# Altium schematic sheet Connectors.SchDoc
size 420 x 297 mm
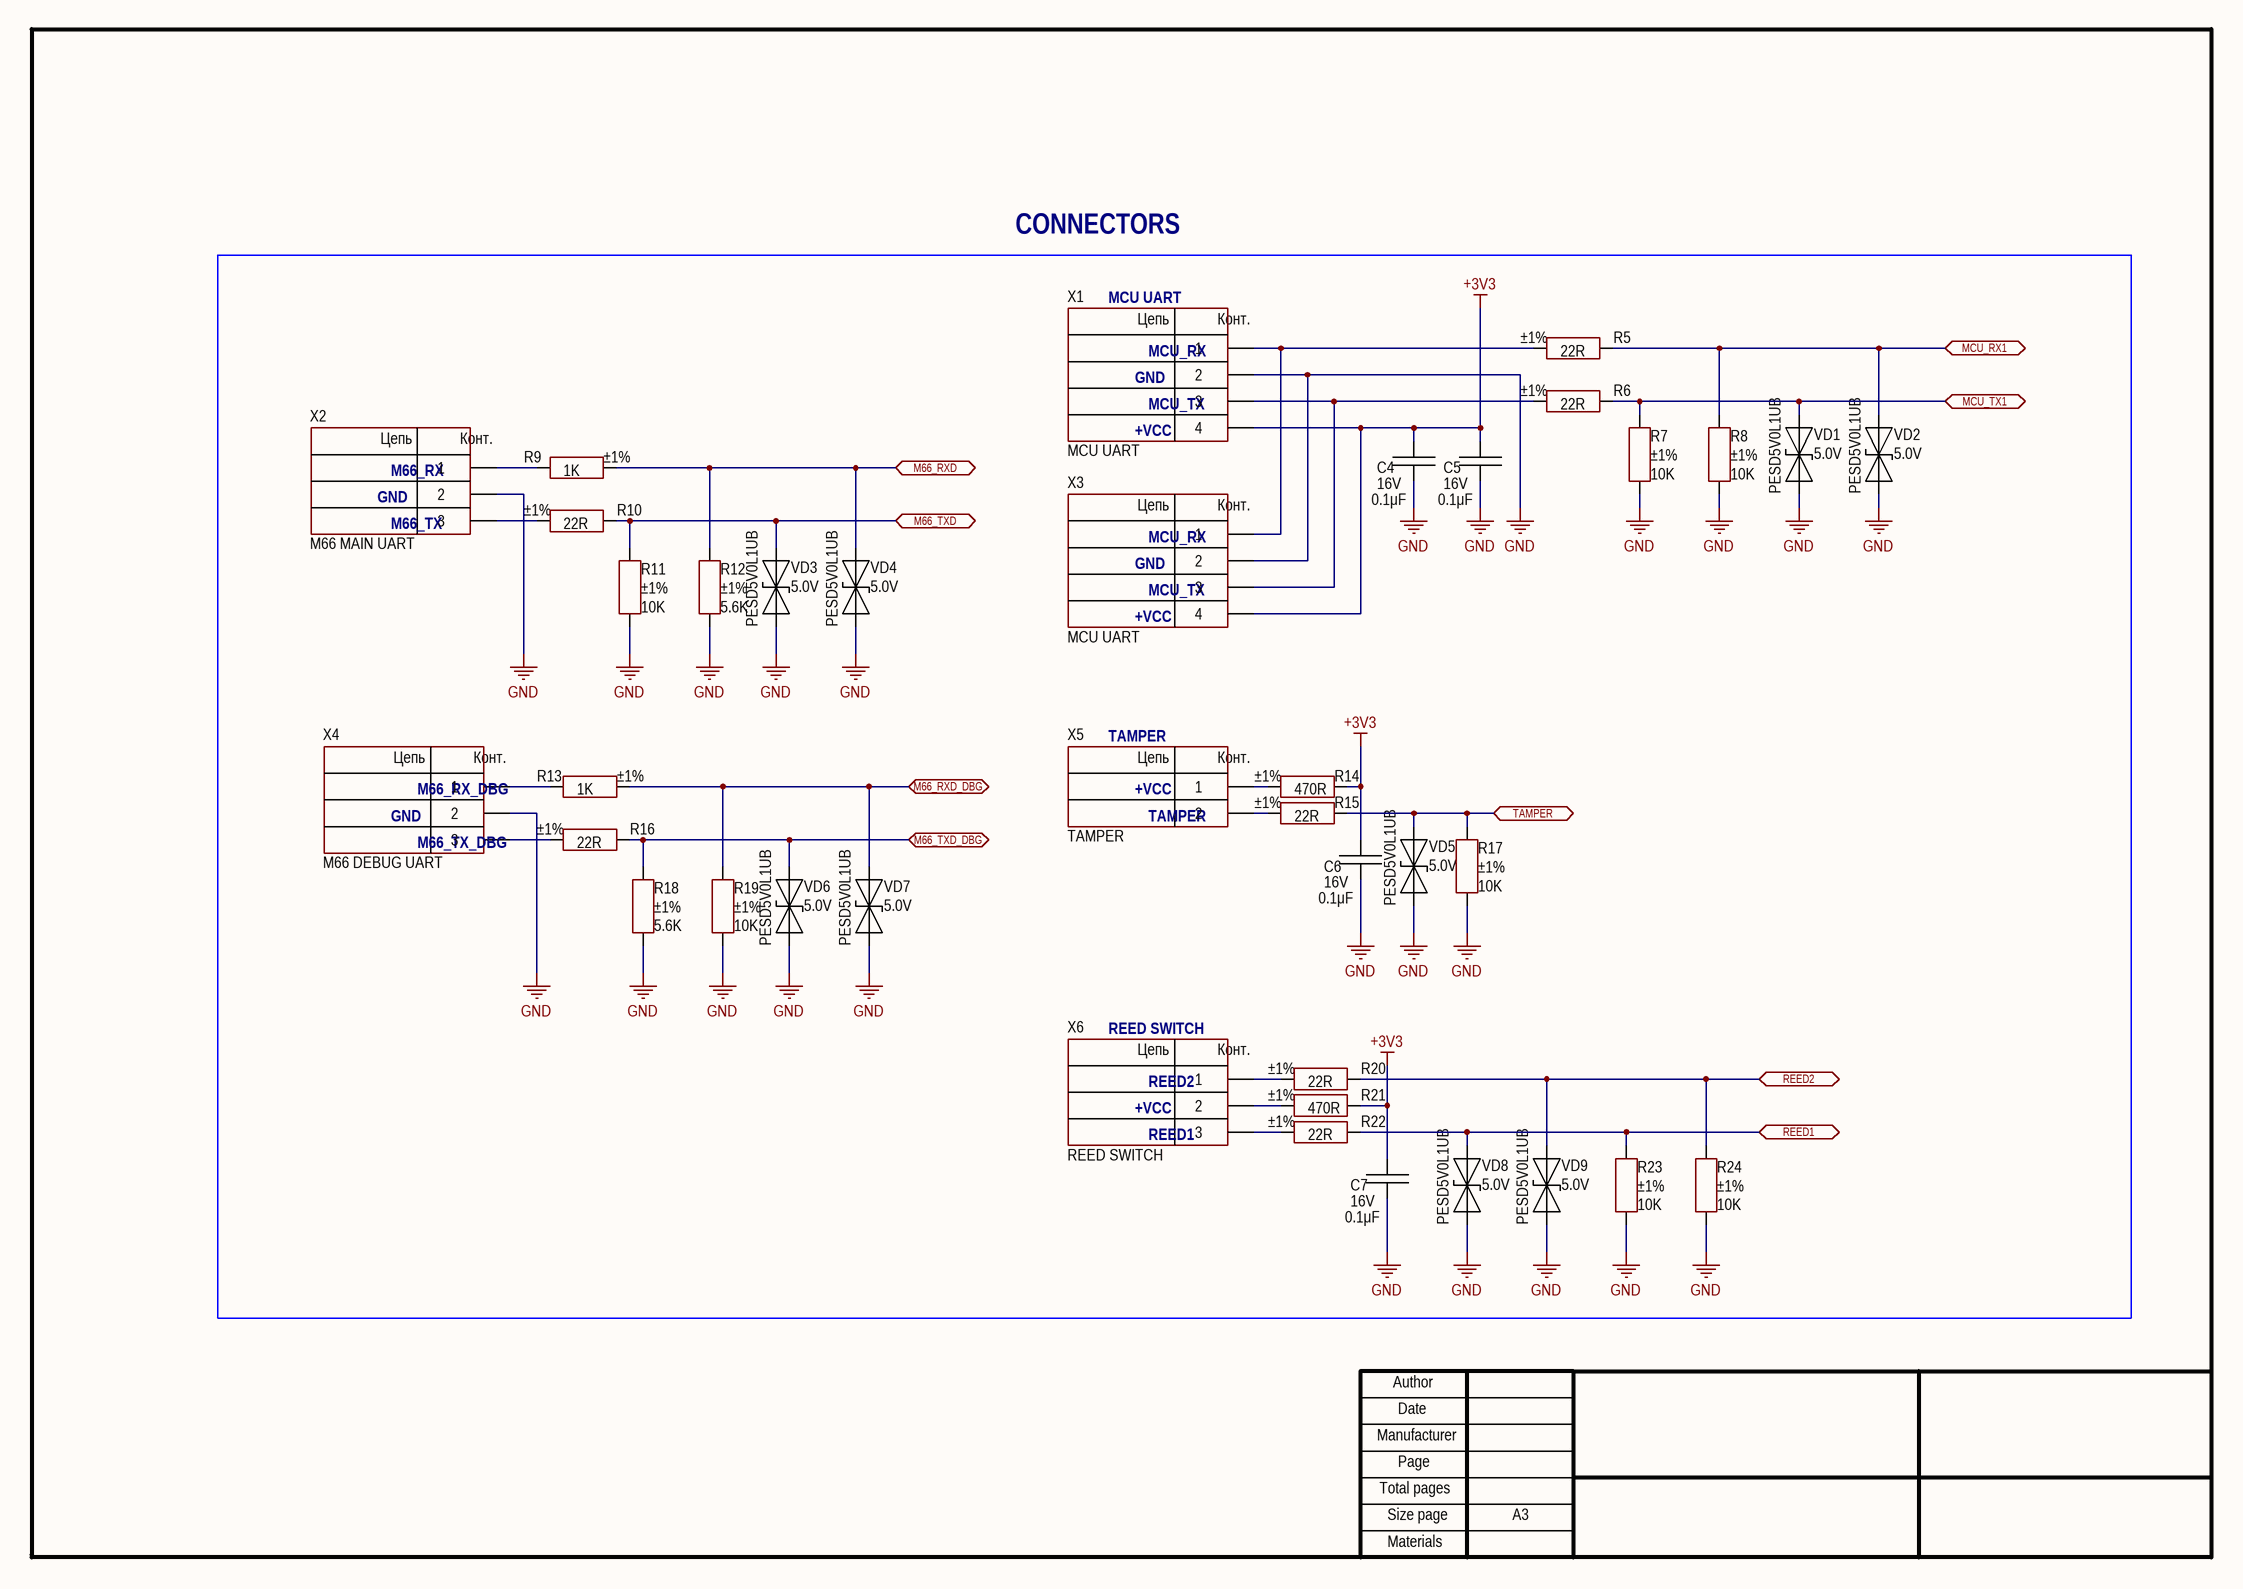
[diagram p0: Connectors.SchDoc]

## Parts
C4  value 0.1μF  Voltage: 16V  [CAP: 0402]
C5  value 0.1μF  Voltage: 16V  [CAP: 0402]
C6  value 0.1μF  Voltage: 16V  [CAP: 0402]
C7  value 0.1μF  Voltage: 16V  [CAP: 0402]
R5  value 22R  Tolerance: ±1%  [RES: 0402]
R6  value 22R  Tolerance: ±1%  [RES: 0402]
R7  value 10K  Tolerance: ±1%  [RES: 0402]
R8  value 10K  Tolerance: ±1%  [RES: 0402]
R9  value 1K  Tolerance: ±1%  [RES: 0402]
R10  value 22R  Tolerance: ±1%  [RES: 0402]
R11  value 10K  Tolerance: ±1%  [RES: 0402]
R12  value 5.6K  Tolerance: ±1%  [RES: 0402]
R13  value 1K  Tolerance: ±1%  [RES: 0402]
R14  value 470R  Tolerance: ±1%  [RES: 0402]
R15  value 22R  Tolerance: ±1%  [RES: 0402]
R16  value 22R  Tolerance: ±1%  [RES: 0402]
R17  value 10K  Tolerance: ±1%  [RES: 0402]
R18  value 5.6K  Tolerance: ±1%  [RES: 0402]
R19  value 10K  Tolerance: ±1%  [RES: 0402]
R20  value 22R  Tolerance: ±1%  [RES: 0402]
R21  value 470R  Tolerance: ±1%  [RES: 0402]
R22  value 22R  Tolerance: ±1%  [RES: 0402]
R23  value 10K  Tolerance: ±1%  [RES: 0402]
R24  value 10K  Tolerance: ±1%  [RES: 0402]
VD1  Voltage: 5.0V  PartNumber: PESD5V0L1UB  [DIODE: SOD523]
VD2  Voltage: 5.0V  PartNumber: PESD5V0L1UB  [DIODE: SOD523]
VD3  Voltage: 5.0V  PartNumber: PESD5V0L1UB  [DIODE: SOD523]
VD4  Voltage: 5.0V  PartNumber: PESD5V0L1UB  [DIODE: SOD523]
VD5  Voltage: 5.0V  PartNumber: PESD5V0L1UB  [DIODE: SOD523]
VD6  Voltage: 5.0V  PartNumber: PESD5V0L1UB  [DIODE: SOD523]
VD7  Voltage: 5.0V  PartNumber: PESD5V0L1UB  [DIODE: SOD523]
VD8  Voltage: 5.0V  PartNumber: PESD5V0L1UB  [DIODE: SOD523]
VD9  Voltage: 5.0V  PartNumber: PESD5V0L1UB  [DIODE: SOD523]
X1  CommentText: MCU UART  [CON: PLS-4]
X2  CommentText: M66 MAIN UART  [CON: PLS-3]
X3  CommentText: MCU UART  [CON: PLS-4]
X4  CommentText: M66 DEBUG UART  [CON: PLS-3]
X5  CommentText: TAMPER  [CON: PLS-2]
X6  CommentText: REED SWITCH  [CON: 282834-3]

## Ports
M66_RXD (bidir), M66_RXD_DBG (bidir), M66_TXD (bidir), M66_TXD_DBG (bidir), MCU_RX1 (bidir), MCU_TX1 (bidir), REED1 (bidir), REED2 (bidir), TAMPER (bidir)

## Nets
+3V3: C4.1 C5.1 C6.1 C7.1 R14.1 R21.1 X1.4 X3.4
GND: C4.2 C5.2 C6.2 C7.2 R7.2 R8.2 R11.1 R12.1 R17.1 R18.1 R19.1 R23.1 R24.1 VD1.1(A) VD2.1(A) VD3.1(A) VD4.1(A) VD5.1(A) VD6.1(A) VD7.1(A) VD8.1(A) VD9.1(A) X1.2 X2.2 X3.2 X4.2
M66_RXD: R9.2 R12.2 VD4.2(C) ; port M66_RXD
M66_RXD_DBG: R13.2 R19.2 VD7.2(C) ; port M66_RXD_DBG
M66_TXD: R10.2 R11.2 VD3.2(C) ; port M66_TXD
M66_TXD_DBG: R16.2 R18.2 VD6.2(C) ; port M66_TXD_DBG
MCU_RX1: R5.2 R8.1 VD2.2(C) ; port MCU_RX1
MCU_TX1: R6.2 R7.1 VD1.2(C) ; port MCU_TX1
REED1: R22.2 R23.2 VD8.2(C) ; port REED1
REED2: R20.2 R24.2 VD9.2(C) ; port REED2
TAMPER: R15.2 R17.2 VD5.2(C) ; port TAMPER
NetR5_1: R5.1 X1.1 X3.1
NetR6_1: R6.1 X1.3 X3.3
NetR9_1: R9.1 X2.1
NetR10_1: R10.1 X2.3
NetR13_1: R13.1 X4.1
NetR14_2: R14.2 X5.1
NetR15_1: R15.1 X5.2
NetR16_1: R16.1 X4.3
NetR20_1: R20.1 X6.1
NetR21_2: R21.2 X6.2
NetR22_1: R22.1 X6.3

## Notes on the sheet
- CONNECTORS
- MCU UART
- GND
- MCU_RX
- +VCC
- MCU_TX
- M66_RX
- M66_TX
- M66_RX_DBG
- TAMPER
- M66_TX_DBG
- (near X6) REED SWITCH
- REED2
- REED1
- Author
- Manufacturer
- Date
- Page
- Total pages
- Size page
- A3
- Materials
- (in symbol KLS2-308V-2.54-03P-4S) Цепь; Конт.
- (in symbol PLS-2) Цепь; Конт.
- (in symbol PLS-3) Цепь; Конт.
- (in symbol PLS-4) Цепь; Конт.

## Library data of the parts
C4-C7 = Ceramic_0402: ±10% 16V Ceramic Capacitor X7R 0402 (1005 Metric); Manufacturer: Yageo; PartNumber: CC0402KRX7R7BB104; ValueManufacturerPartNumber: Ceramic capacitor, 0.1μF, X7R, ±10%, 16V, 0402, -55...+125°C; Package: 0402; HelpURL: https://www.digikey.com/product-detail/en/yageo/CC0402KRX7R7BB104/311-1338-1-ND/2103122; Temperature: -55...+125°C; TypeCapacitor: Ceramic capacitor; Tolerance: ±10%; TypeDielectric: X7R
R5 R6 R10 R15 R16 R20 R22 = Resistor_0402: 22 Ohms ±1% 0.063W, 1/16W Chip Resistor 0402 (1005 Metric) Moisture Resistant Thick Film; Manufacturer: Yageo; PartNumber: RC0402FR-0722RL; ValueManufacturerPartNumber: Resistor film, 22R, ±1%, 0402, 0.063W, -55...+125°C; TypeResistor: Resistor film; Package: 0402; HelpURL: https://www.digikey.com/en/products/detail/yageo/RC0402FR-0722RL/726562; Temperature: -55...+125°C; Power: 0.063W
R7 R8 R11 R17 R19 R23 R24 = Resistor_0402: 10 kOhms ±1% 0.063W, 1/16W Chip Resistor 0402 (1005 Metric) Moisture Resistant Thick Film; Manufacturer: Yageo; PartNumber: RC0402FR-0710KL; ValueManufacturerPartNumber: Resistor film, 10K, ±1%, 0402, 0.063W, -55...+125°C; TypeResistor: Resistor film; Package: 0402; HelpURL: https://www.digikey.com/en/products/detail/yageo/RC0402FR-0710KL/726523; Temperature: -55...+125°C; Power: 0.063W
R9 R13 = Resistor_0402: 1 kOhms ±1% 0.063W, 1/16W Chip Resistor 0402 (1005 Metric) Moisture Resistant Thick Film; Manufacturer: Yageo; PartNumber: RC0402FR-071KP; ValueManufacturerPartNumber: Resistor film, 1K, ±1%, 0402, 0.063W, -55...+125°C; TypeResistor: Resistor film; Package: 0402; HelpURL: https://www.digikey.com/en/products/detail/yageo/RC0402FR-071KP/4935269; Temperature: -55...+125°C; Power: 0.063W
R12 R18 = Resistor_0402: 5.6 kOhms ±1% 0.063W, 1/16W Chip Resistor 0402 (1005 Metric) Moisture Resistant Thick Film; Manufacturer: Yageo; PartNumber: RC0402FR-075K6L; ValueManufacturerPartNumber: Resistor film, 5.6K, ±1%, 0402, 0.063W, -55...+125°C; TypeResistor: Resistor film; Package: 0402; HelpURL: https://www.digikey.com/en/products/detail/yageo/RC0402FR-075K6L/2827590; Temperature: -55...+125°C; Power: 0.063W
R14 R21 = Resistor_0402: 220 Ohms ±1% 0.063W, 1/16W Chip Resistor 0402 (1005 Metric) Moisture Resistant Thick Film; Manufacturer: Yageo; PartNumber: RC0402FR-07470RL; ValueManufacturerPartNumber: Resistor film, 470R, ±1%, 0402, 0.063W, -55...+125°C; TypeResistor: Resistor film; Package: 0402; HelpURL: https://www.digikey.com/en/products/detail/yageo/RC0402FR-07470RL/726619; Temperature: -55...+125°C; Power: 0.063W
VD1-VD9 = TVS_single: 12V Clamp 3.5A (8/20µs) Ipp Tvs Diode Surface Mount SOD-523; Manufacturer: Nexperia; TypeDiode: ESD TVS diode; Package: SOD-523; HelpURL: https://www.digikey.com/en/products/detail/nexperia-usa-inc/PESD5V0L1UB115/2092297; ValueManufacturerPartNumber: =TypeDiode+', '+Voltage+', '+Current+', '+VoltageDrop+', '+RecoveryTime+', '+Package+', '+Temperature; Temperature: -55...+150°C; Current: 3.5A
X1 X3 = PLS-4: Pin Header 4 pin Straight, 2.54mm Through Hole.; Manufacturer: KLS; ValueManufacturerPartNumber: Connector, 4pin, 2.54mm, 500VAC, 3A; PartNumber: KLS1-207-1-02-S; TypeConnector: Connector; VoltageMax: 500VAC; CurrentMax: 3A; Multichannel: 4pin; HelpURL: https://www.klselectronic.com/kls1-207-2-54mm-pitch-male-pin-header-connectors; Pitch: 2.54mm
X2 X4 = PLS-3: Pin Header 3 pin Straight, 2.54mm Through Hole.; Manufacturer: KLS; ValueManufacturerPartNumber: Connector, 3pin, 2.54mm, 500VAC, 3A; PartNumber: KLS1-207-1-03-S; TypeConnector: Connector; VoltageMax: 500VAC; CurrentMax: 3A; Multichannel: 3pin; HelpURL: https://www.klselectronic.com/kls1-207-2-54mm-pitch-male-pin-header-connectors; Pitch: 2.54mm
X5 = PLS-2: Pin Header 2 pin Straight, 2.54mm Through Hole.; Manufacturer: KLS; ValueManufacturerPartNumber: Connector, 2pin, 2.54mm, 500VAC, 3A; PartNumber: KLS1-207-1-02-S; TypeConnector: Connector; VoltageMax: 500VAC; CurrentMax: 3A; Multichannel: 2pin; HelpURL: https://www.klselectronic.com/kls1-207-2-54mm-pitch-male-pin-header-connectors; Pitch: 2.54mm
X6 = KLS2-308V-2.54-03P-4S: 3 Position Wire to Board Terminal Block Horizontal with Board 0.100" (2.54mm) Through Hole; Manufacturer: KLS; TypeConnector: Block Terminal; VoltageMax: 500VAC; CurrentMax: 15A; Multichannel: 3pin; HelpURL: http://www.klsele.com/products/Terminal-blocks/560/278.html; ValueManufacturerPartNumber: =TypeConnector+', '+Multichannel+', '+Pitch+', '+VoltageMax+', '+CurrentMax; PartNumber: KLS2-308V-2.54-03P-4S